# Altium schematic sheet power.SchDoc
size A
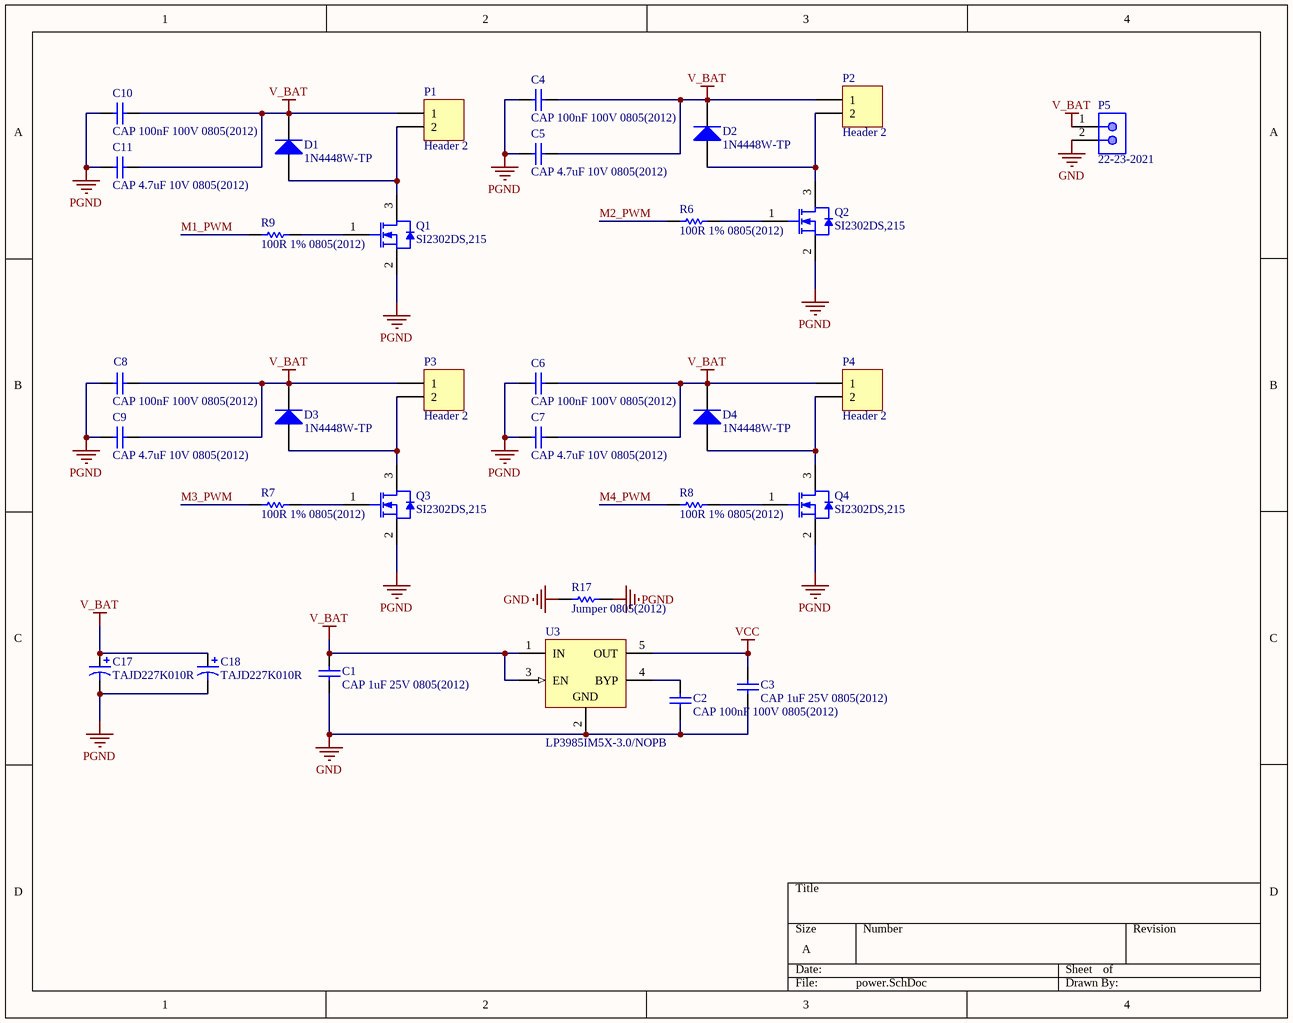
[diagram p0: power.SchDoc]

## Parts
C1  CAP 1uF 25V 0805(2012)  [CAPC0805(2012)100_M]
C2  CAP 100nF 100V 0805(2012)  [CAPC0805(2012)145_N]
C3  CAP 1uF 25V 0805(2012)  [CAPC0805(2012)100_M]
C4  CAP 100nF 100V 0805(2012)  [CAPC0805(2012)145_N]
C5  CAP 4.7uF 10V 0805(2012)  [CAPC0805(2012)155_L]
C6  CAP 100nF 100V 0805(2012)  [CAPC0805(2012)145_N]
C7  CAP 4.7uF 10V 0805(2012)  [CAPC0805(2012)155_L]
C8  CAP 100nF 100V 0805(2012)  [CAPC0805(2012)145_N]
C9  CAP 4.7uF 10V 0805(2012)  [CAPC0805(2012)155_L]
C10  CAP 100nF 100V 0805(2012)  [CAPC0805(2012)145_N]
C11  CAP 4.7uF 10V 0805(2012)  [CAPC0805(2012)155_L]
C17  TAJD227K010R  [AVX-CAPC7343_V]
C18  TAJD227K010R  [AVX-CAPC7343_V]
D1  1N4448W-TP  [MCC-SOD123_V]
D2  1N4448W-TP  [MCC-SOD123_V]
D3  1N4448W-TP  [MCC-SOD123_V]
D4  1N4448W-TP  [MCC-SOD123_V]
P1  Header 2  [HDR1X2]
P2  Header 2  [HDR1X2]
P3  Header 2  [HDR1X2]
P4  Header 2  [HDR1X2]
P5  22-23-2021  [MOLX-22-23-2021_V]
Q1  SI2302DS,215  [NXP-SOT23_N]
Q2  SI2302DS,215  [NXP-SOT23_N]
Q3  SI2302DS,215  [NXP-SOT23_N]
Q4  SI2302DS,215  [NXP-SOT23_N]
R6  100R 1% 0805(2012)  [RESC0805(2012)_L]
R7  100R 1% 0805(2012)  [RESC0805(2012)_L]
R8  100R 1% 0805(2012)  [RESC0805(2012)_L]
R9  100R 1% 0805(2012)  [RESC0805(2012)_L]
R17  Jumper 0805(2012)  [RESC0805(2012)_N]
U3  LP3985IM5X-3.0/NOPB  [MF05A_L]

## Nets
GND: C1.1 C2.1 C3.1 P5.2 R17.1 U3.2(GND)
PGND: C4.1 C5.1 C6.1 C7.1 C8.1 C9.1 C10.1 C11.1 C17.2 C18.2 Q1.2(S) Q2.2(S) Q3.2(S) Q4.2(S) R17.2
V_BAT: C1.2 C4.2 C5.2 C6.2 C7.2 C8.2 C9.2 C10.2 C11.2 C17.1 C18.1 D1.2(K) D2.2(K) D3.2(K) D4.2(K) P1.1 P2.1 P3.1 P4.1 P5.1 U3.1(IN) U3.3(EN)
VCC: C3.2 U3.5(OUT)
M1_PWM: R9.1
M2_PWM: R6.1
M3_PWM: R7.1
M4_PWM: R8.1
NetC2_2: C2.2 U3.4(BYP)
NetD1_1: D1.1(A) P1.2 Q1.3(D)
NetD2_1: D2.1(A) P2.2 Q2.3(D)
NetD3_1: D3.1(A) P3.2 Q3.3(D)
NetD4_1: D4.1(A) P4.2 Q4.3(D)
NetQ1_1: Q1.1(G) R9.2
NetQ2_1: Q2.1(G) R6.2
NetQ3_1: Q3.1(G) R7.2
NetQ4_1: Q4.1(G) R8.2

## Library data of the parts
C1 C3 = CMP-1036-04754-1: CAP 1uF 25V ±10% 0805 (2012 Metric) Thickness 1mm SMD; Case-EIA: 0805; Case-Metric: 2012; Tolerance: Â±10%; Max Thickness: 1 mm; Value: 1uF; Rated Voltage: 25 V; Technology: SMT
C2 C4 C6 C8 C10 = CMP-1036-04431-1: CAP 100nF 100V ±20% 0805 (2012 Metric) Thickness 1.45mm SMD; Case-Metric: 2012; Tolerance: Â±20%; Case-EIA: 0805; Value: 100nF; Technology: SMT; Rated Voltage: 100 V; Max Thickness: 1.45 mm
C5 C7 C9 C11 = CMP-1036-04882-1: CAP 4.7uF 10V ±10% 0805 (2012 Metric) Thickness 1.55mm SMD; Case-EIA: 0805; Tolerance: Â±10%; Case-Metric: 2012; Rated Voltage: 10 V; Max Thickness: 1.55 mm; Technology: SMT; Value: 4.7uF
C17 C18 = CMP-0279-00002-2: Capacitor, Tantalum, 220uF 10% 10V MCCT-D (7343-31); Manufacturer: AVX; Polarity: Polarized; Tolerance: 10%; Rated Voltage: 10V; Technology: Tantalum; ComponentLink2Description: Datasheet; PartNumber: TAJD227K010R; ComponentLink2URL: http://www.avx.com/docs/Catalogs/taj.pdf; ComponentLink1URL: http://www.avx.com/; ComponentLink1Description: Manufacturer URL; Capacitance: 220uF; PackageDescription: 2-Pin SMT Capacitor, 7.3 x 4.3 mm Body; Mounting Technology: Surface Mount; DatasheetVersion: Jul-13; PackageReference: CAPC7343
D1-D4 = CMP-0862-00001-1: Switching Diode, 500 mW, 100 V, -55 to 150 degC, SOD123, RoHS, Tape and Reel; Manufacturer: Micro Commercial Components; FV: 1 V Max.; Trr: 4 nS; IF (AV): 250 mA; VRM (PRV): 100 V; PD: 500 mW; Typical Junction Capacitance: 4 pF; IR: 25 nA; ComponentLink1Description: Manufacturer URL; PackageVersion: Rev. C; ComponentLink2URL: http://www.mccsemi.com/up_pdf/1N4448W(SOD-123).pdf; DatasheetVersion: Rev. C; ComponentLink3Description: Package Specification; PackageDescription: 2-Pin SOD123, Body 2.7 x 1.6 mm, Height 1.35 mm; ComponentLink3URL: http://www.mccsemi.com/up_pdf/1N4448W(SOD-123).pdf; Operating Temperature Range: -55 to 150 degC; PackageReference: SOD123; PartNumber: 1N4448W-TP; Packing: Tape and Reel; ComponentLink1URL: http://www.mccsemi.com/; RoHS: TRUE; ComponentLink2Description: Datasheet; Mounting Technology: Surface Mount
P1-P4 = Header 2: Header, 2-Pin; LatestRevisionDate: 17-Jul-2002; LatestRevisionNote: Re-released for DXP Platform.; Publisher: Altium Limited
P5 = CMP-1704-00001-3: Male Header, Pitch 2.54 mm, 1 x 2 Position, Height 10.67 mm, Tail Length 3.56 mm, 0 to 75 degC, RoHS, Bulk; Package Quantity: 3000; Height: 10.67 mm; RoHSCompliant: True; ComponentLink2URL: https://datasheet.ciiva.com/19454/232266-19454304.pdf; PartNumber: 22-23-2021; Packaging: Bulk; ComponentLink2Description: Datasheet; Min Operating Temperature: 0 degC; ComponentLink1Description: Manufacturer URL; Length: 5.08 mm; Mounting Technology: Through Hole; Max Operating Temperature: 75 degC; REACH SVHC: Unknown; PackageDescription: Male Header, Pitch 2.54 mm, 1 x 2 Position, Height 10.67 mm, Tail Length 3.56 mm; ComponentLink1URL: http://www.molex.com/; Mount: Through Hole; Radiation Hardening: No; Width: 6.35 mm; Pins: 2
Q1-Q4 = CMP-1258-00133-1: N-Channel Enhancement Mode Field-Effect Transistor, 20 V, 2.5 A, 3-Pin SOT23, Tape and Reel; Manufacturer: NXP Semiconductors; Ciss [typ] (pF): 230; VDS [max] (V): 20; Channel Type: N; Coss [typ] (pF): 125; ID [max] (A): 2.5; Packing: Tape & Reel; DatasheetVersion: Rev. 02; PackageVersion: 06-03-16, 03/2006; Code_JEDEC: TO-236AB; ComponentLink3Description: Package Specification; PartNumber: SI2302DS,215; ComponentLink2URL: http://www.nxp.com/documents/data_sheet/SI2302DS.pdf; PackageDescription: 3-Pin Small Outline Transistor Package, Body 2.9 x 1.3 mm, Pitch 0.95 mm; ComponentLink2Description: Datasheet; ComponentLink1Description: Manufacturer URL; Mounting Technology: Surface Mount; ComponentLink1URL: http://www.nxp.com/; ComponentLink3URL: http://www.nxp.com/documents/outline_drawing/sot023_po.pdf; PackageReference: SOT23
R6-R9 = CMP-1013-00397-1: 100R 0.125W 1% 0805 (2012 Metric)  SMD; Value: 100.00 Ohm; Case-Metric: 2012; Case-EIA: 0805; Technology: SMT; Power: 0.125 W; Tolerance: 1 %
R17 = CMP-1013-00001-1: Jumper 0805 (2012 Metric); Case-EIA: 0805; Value: 0.00 Ohm; Tolerance: None; Case-Metric: 2012; Technology: SMT; Power: None
U3 = CMP-0062-01849-2: Micropower, 150mA Low-Noise Ultra Low-Dropout CMOS Voltage Regulator, 5-pin SOT-23, Pb-Free; Manufacturer: National Semiconductor; CompType: LDO IC; PowerWise: N; PackageTopMarking: LCRB*XTT; PackageVersion: revD, Aug-2008; DatasheetVersion: Aug-2005; ComponentLink2Description: LP3985 Web Page; RevisionNote: Component URLs added; ComponentLink3Description: MF05A Package Page; ComponentLink2URL: http://www.national.com/pf/LP/LP3985.html; ComponentLink1URL: http://www.national.com/ds/LP/LP3985.pdf; PinCount: 5; PackageDescription: Molded SOT-23, .115 x .063 x .040 in Body, 5 Lead, .0375 in Pitch; ComponentLink1Description: LP3985 Datasheet; RoHS: Y; ComponentLink3URL: http://www.national.com/packaging/folders/mf05a.html; PackageReference: MF05A